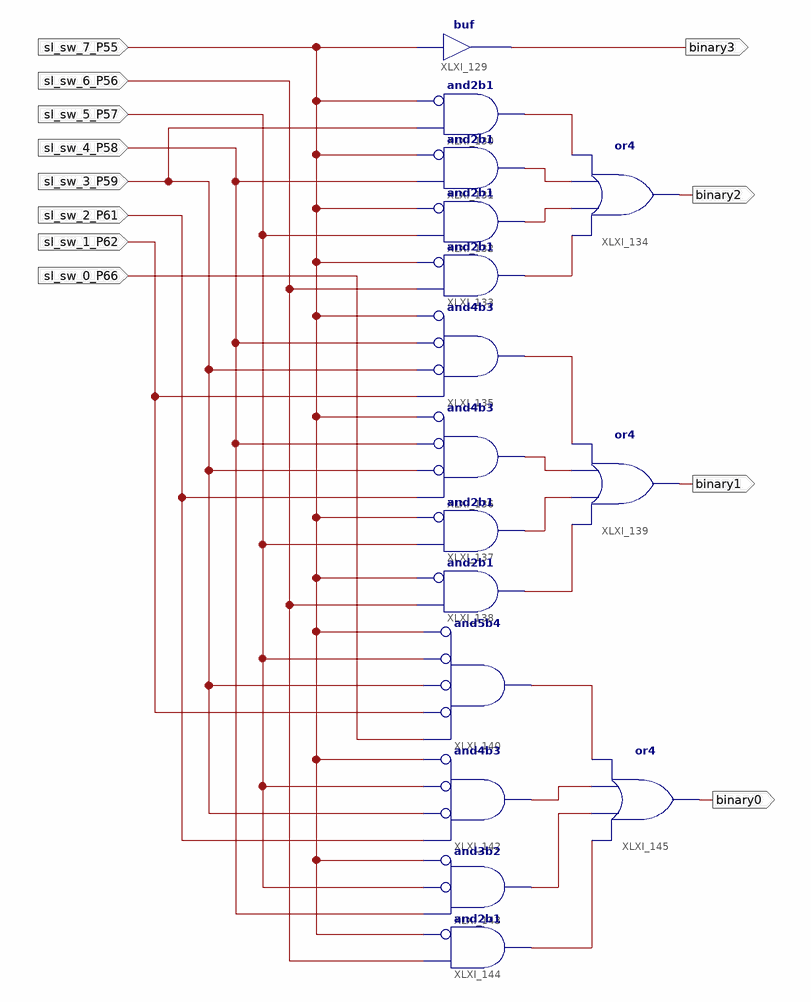
[diagram p0: schematic sheet 1]
// Xilinx ISE schematic lab9_201_runner.sch (spartan6) as structural Verilog: 16 symbols, 12 ports
module lab9_201_runner (
  input  sl_sw_7_P55,
  input  sl_sw_6_P56,
  input  sl_sw_5_P57,
  input  sl_sw_4_P58,
  input  sl_sw_3_P59,
  input  sl_sw_2_P61,
  input  sl_sw_1_P62,
  input  sl_sw_0_P66,
  output binary3,
  output binary2,
  output binary1,
  output binary0
);

  wire XLXN_222, XLXN_223, XLXN_224, XLXN_225, XLXN_227, XLXN_228, XLXN_229, XLXN_230, XLXN_232, XLXN_233,
       XLXN_234, XLXN_235;

  and XLXI_130 (XLXN_222, ~sl_sw_7_P55, sl_sw_3_P59);  // and2b1
  and XLXI_131 (XLXN_223, ~sl_sw_7_P55, sl_sw_4_P58);  // and2b1
  and XLXI_132 (XLXN_224, ~sl_sw_7_P55, sl_sw_5_P57);  // and2b1
  and XLXI_133 (XLXN_225, ~sl_sw_7_P55, sl_sw_6_P56);  // and2b1
  buf XLXI_129 (binary3, sl_sw_7_P55);
  or XLXI_134 (binary2, XLXN_222, XLXN_223, XLXN_224, XLXN_225);
  and XLXI_135 (XLXN_227, ~sl_sw_7_P55, ~sl_sw_4_P58, ~sl_sw_3_P59, sl_sw_1_P62);  // and4b3
  and XLXI_136 (XLXN_228, ~sl_sw_7_P55, ~sl_sw_4_P58, ~sl_sw_3_P59, sl_sw_2_P61);  // and4b3
  and XLXI_137 (XLXN_229, ~sl_sw_7_P55, sl_sw_5_P57);  // and2b1
  and XLXI_138 (XLXN_230, ~sl_sw_7_P55, sl_sw_6_P56);  // and2b1
  or XLXI_139 (binary1, XLXN_227, XLXN_228, XLXN_229, XLXN_230);
  and XLXI_140 (XLXN_232, ~sl_sw_7_P55, ~sl_sw_5_P57, ~sl_sw_3_P59, ~sl_sw_1_P62, sl_sw_0_P66);  // and5b4
  and XLXI_142 (XLXN_233, ~sl_sw_7_P55, ~sl_sw_5_P57, ~sl_sw_3_P59, sl_sw_2_P61);  // and4b3
  and XLXI_143 (XLXN_234, ~sl_sw_7_P55, ~sl_sw_5_P57, sl_sw_4_P58);  // and3b2
  and XLXI_144 (XLXN_235, ~sl_sw_7_P55, sl_sw_6_P56);  // and2b1
  or XLXI_145 (binary0, XLXN_232, XLXN_233, XLXN_234, XLXN_235);
endmodule
